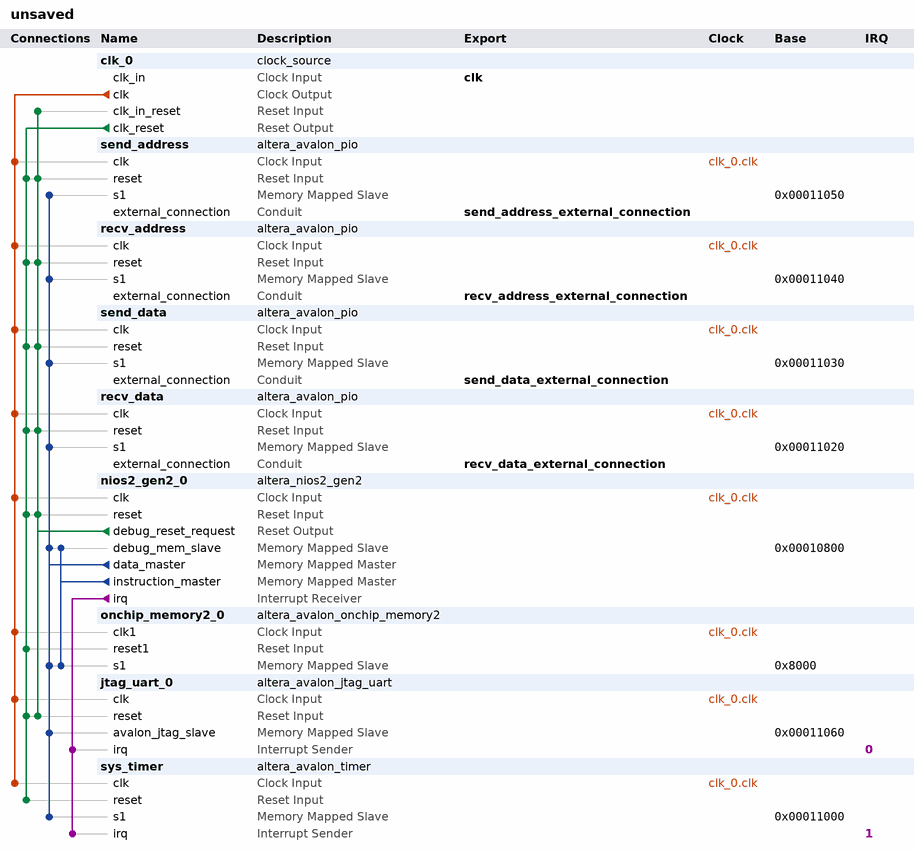
[diagram p0: system contents]
# Platform Designer (Qsys) system unsaved, Cyclone IV E EP4CE115F29C7
# Parameters at their usual value, and those the tool derives, are not listed.
package require -exact qsys 18.1
create_system unsaved
set_project_property DEVICE_FAMILY {Cyclone IV E}
set_project_property DEVICE EP4CE115F29C7

add_instance clk_0 clock_source 18.1
set_instance_parameter_value clk_0 clockFrequency 50000000

add_instance send_address altera_avalon_pio 18.1
set_instance_parameter_value send_address direction Output
set_instance_parameter_value send_address width 8

add_instance recv_address altera_avalon_pio 18.1
set_instance_parameter_value recv_address direction Input
set_instance_parameter_value recv_address width 8

add_instance send_data altera_avalon_pio 18.1
set_instance_parameter_value send_data direction Output
set_instance_parameter_value send_data width 32

add_instance recv_data altera_avalon_pio 18.1
set_instance_parameter_value recv_data direction Input
set_instance_parameter_value recv_data width 32

add_instance nios2_gen2_0 altera_nios2_gen2 18.1
set_instance_parameter_value nios2_gen2_0 cpuID 1
set_instance_parameter_value nios2_gen2_0 dcache_size 2048
set_instance_parameter_value nios2_gen2_0 exceptionSlave onchip_memory2_0.s1
set_instance_parameter_value nios2_gen2_0 icache_size 4096
set_instance_parameter_value nios2_gen2_0 impl Fast
set_instance_parameter_value nios2_gen2_0 resetSlave onchip_memory2_0.s1

add_instance onchip_memory2_0 altera_avalon_onchip_memory2 18.1
set_instance_parameter_value onchip_memory2_0 dataWidth 32
set_instance_parameter_value onchip_memory2_0 dualPort false
set_instance_parameter_value onchip_memory2_0 initMemContent true
set_instance_parameter_value onchip_memory2_0 initializationFileName onchip_mem.hex
set_instance_parameter_value onchip_memory2_0 memorySize 20480

add_instance jtag_uart_0 altera_avalon_jtag_uart 18.1
set_instance_parameter_value jtag_uart_0 simInteractiveOptions NO_INTERACTIVE_WINDOWS

add_instance sys_timer altera_avalon_timer 18.1
set_instance_parameter_value sys_timer period 1
set_instance_parameter_value sys_timer periodUnits MSEC

# connections
add_connection clk_0.clk jtag_uart_0.clk clock
add_connection clk_0.clk nios2_gen2_0.clk clock
add_connection clk_0.clk onchip_memory2_0.clk1 clock
add_connection clk_0.clk recv_address.clk clock
add_connection clk_0.clk recv_data.clk clock
add_connection clk_0.clk send_address.clk clock
add_connection clk_0.clk send_data.clk clock
add_connection clk_0.clk sys_timer.clk clock
add_connection clk_0.clk_reset jtag_uart_0.reset reset
add_connection clk_0.clk_reset nios2_gen2_0.reset reset
add_connection clk_0.clk_reset onchip_memory2_0.reset1 reset
add_connection clk_0.clk_reset recv_address.reset reset
add_connection clk_0.clk_reset recv_data.reset reset
add_connection clk_0.clk_reset send_address.reset reset
add_connection clk_0.clk_reset send_data.reset reset
add_connection clk_0.clk_reset sys_timer.reset reset
add_connection nios2_gen2_0.debug_reset_request clk_0.clk_in_reset reset
add_connection nios2_gen2_0.debug_reset_request jtag_uart_0.reset reset
add_connection nios2_gen2_0.debug_reset_request nios2_gen2_0.reset reset
add_connection nios2_gen2_0.debug_reset_request recv_address.reset reset
add_connection nios2_gen2_0.debug_reset_request recv_data.reset reset
add_connection nios2_gen2_0.debug_reset_request send_address.reset reset
add_connection nios2_gen2_0.debug_reset_request send_data.reset reset
add_connection nios2_gen2_0.data_master jtag_uart_0.avalon_jtag_slave avalon
set_connection_parameter_value nios2_gen2_0.data_master/jtag_uart_0.avalon_jtag_slave baseAddress 0x00011060
add_connection nios2_gen2_0.data_master nios2_gen2_0.debug_mem_slave avalon
set_connection_parameter_value nios2_gen2_0.data_master/nios2_gen2_0.debug_mem_slave baseAddress 0x00010800
add_connection nios2_gen2_0.data_master onchip_memory2_0.s1 avalon
set_connection_parameter_value nios2_gen2_0.data_master/onchip_memory2_0.s1 baseAddress 0x8000
add_connection nios2_gen2_0.data_master recv_address.s1 avalon
set_connection_parameter_value nios2_gen2_0.data_master/recv_address.s1 baseAddress 0x00011040
add_connection nios2_gen2_0.data_master recv_data.s1 avalon
set_connection_parameter_value nios2_gen2_0.data_master/recv_data.s1 baseAddress 0x00011020
add_connection nios2_gen2_0.data_master send_address.s1 avalon
set_connection_parameter_value nios2_gen2_0.data_master/send_address.s1 baseAddress 0x00011050
add_connection nios2_gen2_0.data_master send_data.s1 avalon
set_connection_parameter_value nios2_gen2_0.data_master/send_data.s1 baseAddress 0x00011030
add_connection nios2_gen2_0.data_master sys_timer.s1 avalon
set_connection_parameter_value nios2_gen2_0.data_master/sys_timer.s1 baseAddress 0x00011000
add_connection nios2_gen2_0.instruction_master nios2_gen2_0.debug_mem_slave avalon
set_connection_parameter_value nios2_gen2_0.instruction_master/nios2_gen2_0.debug_mem_slave baseAddress 0x00010800
add_connection nios2_gen2_0.instruction_master onchip_memory2_0.s1 avalon
set_connection_parameter_value nios2_gen2_0.instruction_master/onchip_memory2_0.s1 baseAddress 0x8000
add_connection nios2_gen2_0.irq jtag_uart_0.irq interrupt
set_connection_parameter_value nios2_gen2_0.irq/jtag_uart_0.irq irqNumber 0
add_connection nios2_gen2_0.irq sys_timer.irq interrupt
set_connection_parameter_value nios2_gen2_0.irq/sys_timer.irq irqNumber 1

# exported interfaces
add_interface clk clock sink
set_interface_property clk EXPORT_OF clk_0.clk_in
add_interface recv_address_external_connection conduit end
set_interface_property recv_address_external_connection EXPORT_OF recv_address.external_connection
add_interface recv_data_external_connection conduit end
set_interface_property recv_data_external_connection EXPORT_OF recv_data.external_connection
add_interface send_address_external_connection conduit end
set_interface_property send_address_external_connection EXPORT_OF send_address.external_connection
add_interface send_data_external_connection conduit end
set_interface_property send_data_external_connection EXPORT_OF send_data.external_connection

set_interconnect_requirement {$system} qsys_mm.clockCrossingAdapter HANDSHAKE
set_interconnect_requirement {$system} qsys_mm.enableEccProtection FALSE
set_interconnect_requirement {$system} qsys_mm.insertDefaultSlave FALSE
set_interconnect_requirement {$system} qsys_mm.maxAdditionalLatency 1

save_system unsaved.qsys
